# Altium project MiniRacer_V2.PrjPCB
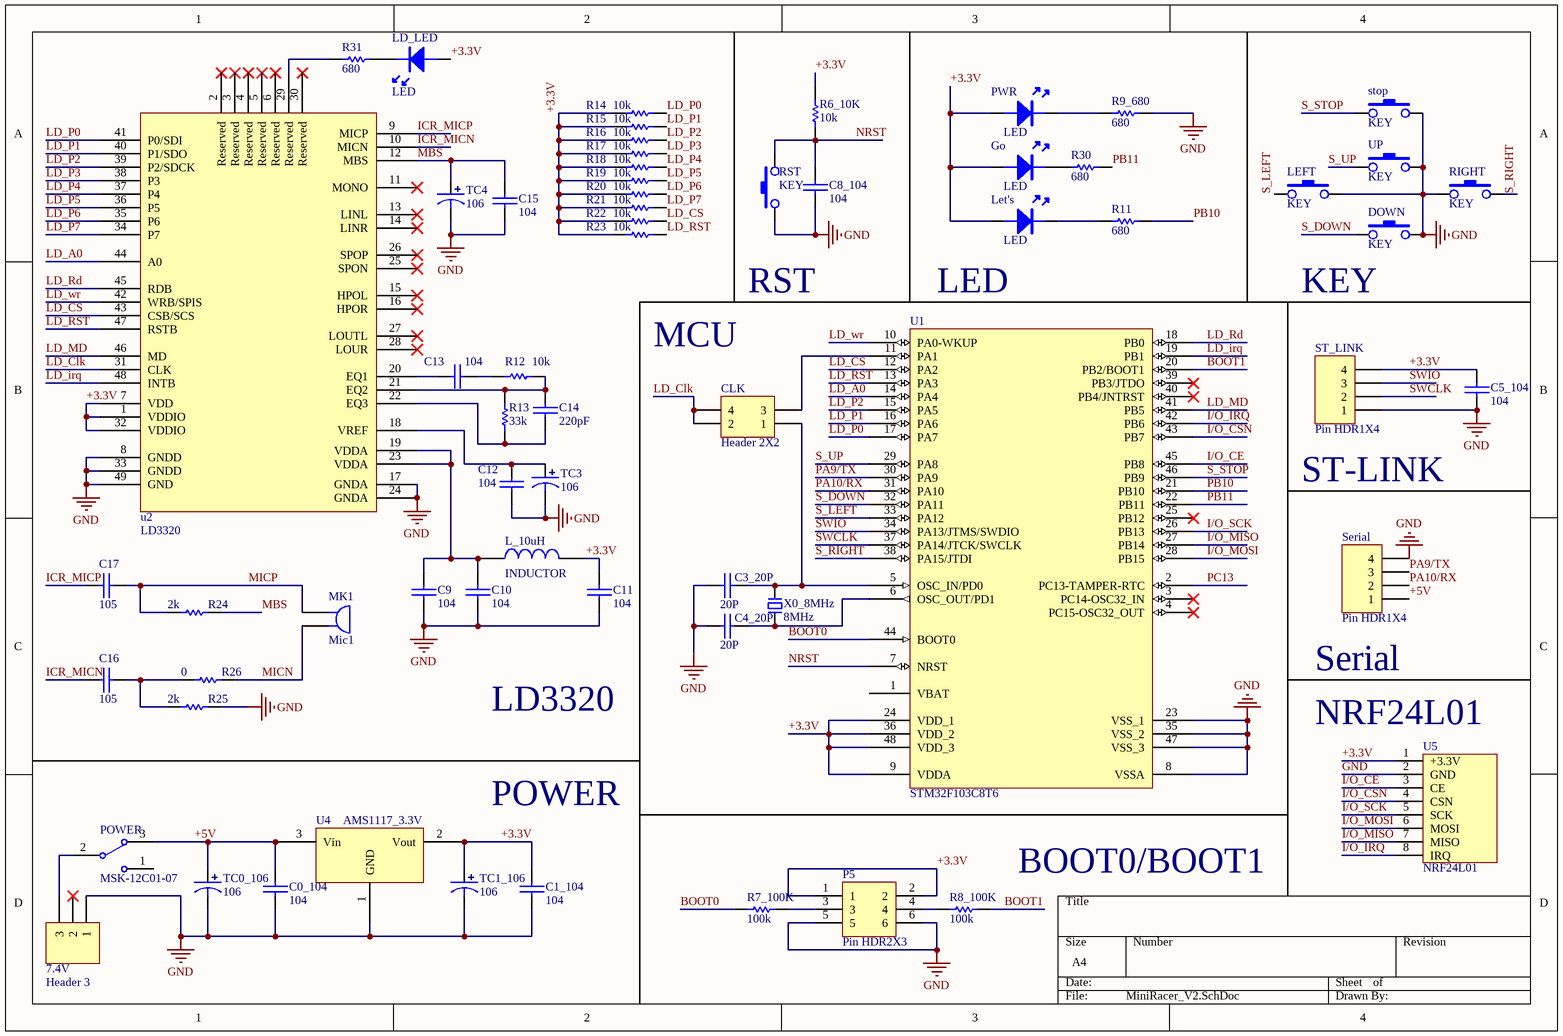
[diagram p0: MiniRacer_V2.SchDoc]
1 sheet, 64 parts. Net scope: global (net labels, ports and power ports of the same name join across sheets).
Board file: MiniRacer_V2.PcbDoc

## Sheet MiniRacer_V2.SchDoc
size A4

### Parts
7.4V  Header 3  [HDR1X3]
C0_104  104  [0603C]
C1_104  104  [0603C]
C3_20P  20P  [0603C]
C4_20P  20P  [0603C]
C5_104  104  [0603C]
C8_104  104  [0603C]
C9  104  [0603C]
C10  104  [0603C]
C11  104  [0603C]
C12  104  [0603C]
C13  104  [0603C]
C14  220pF  [0603C]
C15  104  [0603C]
C16  105  [0603C]
C17  105  [0603C]
CLK  Header 2X2  [HDR2X2]
DOWN  KEY  [DIP-3X6X4.3]
Go  LED  [LED-0603Y]
L_10uH  INDUCTOR  [0603L]
LD_LED  LED  [LED-0603Y]
LEFT  KEY  [DIP-3X6X4.3]
Let's  LED  [LED-0603Y]
MK1  Mic1  [PIN2]
P5  Pin HDR2X3  [Pin HDR2X3/2.54mm-S]
POWER  MSK-12C01-07  [MSK-12C01-07]
PWR  LED  [LED-0603Y]
R6_10K  10k  [0603R]
R7_100K  100k  [0603R]
R8_100K  100k  [0603R]
R9_680  680  [0603R]
R11  680  [0603R]
R12  10k  [0603R]
R13  33k  [0603R]
R14  10k  [0603R]
R15  10k  [0603R]
R16  10k  [0603R]
R17  10k  [0603R]
R18  10k  [0603R]
R19  10k  [0603R]
R20  10k  [0603R]
R21  10k  [0603R]
R22  10k  [0603R]
R23  10k  [0603R]
R24  2k  [0603R]
R25  2k  [0603R]
R26  0  [0603R]
R30  680  [0603R]
R31  680  [0603R]
RIGHT  KEY  [DIP-3X6X4.3]
RST  KEY  [SMD-3X6X2.5]
Serial  Pin HDR1X4  [HDR1X4]
ST_LINK  Pin HDR1X4  [HDR1X4]
stop  KEY  [DIP-3X6X4.3]
TC0_106  106  [TAJ-A/3216]
TC1_106  106  [TAJ-A/3216]
TC3  106  [TAJ-A/3216]
TC4  106  [TAJ-A/3216]
U1  STM32F103C8T6  [LQFP48 7X7]
u2  LD3320  [QFN50P700X700-48VAN]
U4  AMS1117_3.3V  [SOT223]
U5  NRF24L01  [NRF24L01]
UP  KEY  [DIP-3X6X4.3]
X0_8MHz  8MHz  [OSC 5032-2P]

### Nets
GND: 7.4V.1 C0_104.1 C1_104.1 C3_20P.2 C4_20P.2 C5_104.2 C8_104.2 C9.2 C10.2 C11.2 C12.2 C15.2 DOWN.3 LEFT.3 P5.5 P5.6 R9_680.1 R25.2 RIGHT.1 RST.1 Serial.4 ST_LINK.1 stop.3 TC0_106.2 TC1_106.2 TC3.2 TC4.2 U1.8(VSSA) U1.23(VSS_1) U1.35(VSS_2) U1.47(VSS_3) u2.8(GNDD) u2.17(GNDA) u2.24(GNDA) u2.33(GNDD) u2.49(GND) U4.1(GND) U5.2(GND) UP.3
+3.3V: C1_104.2 C5_104.1 C11.1 Go.A L_10uH.2 LD_LED.A Let's.A P5.1 P5.2 PWR.A R6_10K.2 R14.1 R15.1 R16.1 R17.1 R18.1 R19.1 R20.1 R21.1 R22.1 R23.1 ST_LINK.4 TC1_106.1 U1.9(VDDA) U1.24(VDD_1) U1.36(VDD_2) U1.48(VDD_3) u2.1(VDDIO) u2.7(VDD) u2.32(VDDIO) U4.2(Vout) U5.1(+3.3V)
+5V: C0_104.2 POWER.3 Serial.1 TC0_106.1 U4.3(Vin)
BOOT0: R7_100K.2 U1.44(BOOT0)
BOOT1: R8_100K.1 U1.20(PB2/BOOT1)
I/O_CE: U1.45(PB8) U5.3(CE)
I/O_CSN: U1.43(PB7) U5.4(CSN)
I/O_IRQ: U1.42(PB6) U5.8(IRQ)
I/O_MISO: U1.27(PB14) U5.7(MISO)
I/O_MOSI: U1.28(PB15) U5.6(MOSI)
I/O_SCK: U1.26(PB13) U5.5(SCK)
ICR_MICN: C16.1 u2.10(MICN)
ICR_MICP: C17.1 u2.9(MICP)
LD_A0: U1.14(PA4) u2.44(A0)
LD_Clk: CLK.2 CLK.4 u2.31(CLK)
LD_CS: R22.2 U1.12(PA2) u2.43(CSB/SCS)
LD_irq: U1.19(PB1) u2.48(INTB)
LD_MD: U1.41(PB5) u2.46(MD)
LD_P0: R14.2 U1.17(PA7) u2.41(P0/SDI)
LD_P1: R15.2 U1.16(PA6) u2.40(P1/SDO)
LD_P2: R16.2 U1.15(PA5) u2.39(P2/SDCK)
LD_P3: R17.2 u2.38(P3)
LD_P4: R18.2 u2.37(P4)
LD_P5: R19.2 u2.36(P5)
LD_P6: R20.2 u2.35(P6)
LD_P7: R21.2 u2.34(P7)
LD_Rd: U1.18(PB0) u2.45(RDB)
LD_RST: R23.2 U1.13(PA3) u2.47(RSTB)
LD_wr: U1.10(PA0-WKUP) u2.42(WRB/SPIS)
MBS: C15.1 R24.2 TC4.1 u2.12(MBS)
MICN: MK1.2 R26.2
MICP: C17.2 MK1.1 R24.1
NRST: C8_104.1 R6_10K.1 RST.3 U1.7(NRST)
PA9/TX: Serial.3 U1.30(PA9)
PA10/RX: Serial.2 U1.31(PA10)
PB10: R11.1 U1.21(PB10)
PB11: R30.1 U1.22(PB11)
PC13: U1.2(PC13-TAMPER-RTC)
S_DOWN: DOWN.1 U1.32(PA11)
S_LEFT: LEFT.1 U1.33(PA12)
S_RIGHT: RIGHT.3 U1.38(PA15/JTDI)
S_STOP: stop.1 U1.46(PB9)
S_UP: U1.29(PA8) UP.1
SWCLK: ST_LINK.2 U1.37(PA14/JTCK/SWCLK)
SWIO: ST_LINK.3 U1.34(PA13/JTMS/SWDIO)
Net7.4V_3: 7.4V.3 POWER.2
NetC3_20P_1: C3_20P.1 CLK.1 U1.5(OSC_IN/PD0) X0_8MHz.2
NetC4_20P_1: C4_20P.1 U1.6(OSC_OUT/PD1) X0_8MHz.1
NetC9_1: C9.1 C10.1 L_10uH.1 u2.19(VDDA) u2.23(VDDA)
NetC12_1: C12.1 TC3.1 u2.18(VREF)
NetC13_1: C13.1 u2.20(EQ1)
NetC13_2: C13.2 R12.2
NetC14_1: C14.1 R12.1 R13.1 u2.21(EQ2)
NetC14_2: C14.2 R13.2 u2.22(EQ3)
NetC16_2: C16.2 R25.1 R26.1
NetCLK_3: CLK.3 U1.11(PA1)
NetGo_K: Go.K R30.2
NetLD_LED_K: LD_LED.K R31.2
NetLet's_K: Let's.K R11.2
NetP5_3: P5.3 R7_100K.1
NetP5_4: P5.4 R8_100K.2
NetPWR_K: PWR.K R9_680.2
NetR31_1: R31.1 u2.29(Reserved)

Not connected (* = marked no-connect by the designer): 7.4V 2*; POWER 1; U1 1(VBAT) 3(PC14-OSC32_IN)* 4(PC15-OSC32_OUT)* 25(PB12)* 39(PB3/JTDO)* 40(PB4/JNTRST)*; u2 2(Reserved)* 3(Reserved)* 4(Reserved)* 5(Reserved)* 6(Reserved)* 11(MONO)* 13(LINL)* 14(LINR)* 15(HPOL)* 16(HPOR)* 25(SPON)* 26(SPOP)* 27(LOUTL)* 28(LOUR)* 30(Reserved)*

### Notes on the sheet
- RST
- LED
- (near DOWN) KEY
- MCU
- (near ST_LINK) ST-LINK
- LD3320
- (near Serial) Serial
- (near U5) NRF24L01
- POWER
- BOOT0/BOOT1

### Library data of the parts
7.4V = Header 3: Header, 3-Pin; LatestRevisionDate: 17-Jul-2002; LatestRevisionNote: Re-released for DXP Platform.; Publisher: Altium Limited
C0_104 C1_104 C3_20P C4_20P C5_104 C8_104 C9-C17 = CAP: 无极性电容
CLK = Header 2X2: Header, 2-Pin, Dual row; LatestRevisionDate: 17-Jul-2002; LatestRevisionNote: Re-released for DXP Platform.; Publisher: Altium Limited
MK1 = Mic1: Microphone; Published: 24-Mar-1999; LatestRevisionDate: 17-Jul-2002; LatestRevisionNote: Re-released for DXP Platform.; PackageReference: PIN2; Publisher: Altium Limited
R6_10K R7_100K R8_100K R9_680 R11-R26 R30 R31 = RES
Serial ST_LINK = Header 4: Header, 4-Pin; LatestRevisionDate: 17-Jul-2002; LatestRevisionNote: Re-released for DXP Platform.; Publisher: Altium Limited
TC0_106 TC1_106 TC3 TC4 = TCAP: 钽电容
U4 = AMS1117: 三端稳压芯片
X0_8MHz = XTAL-2P: 2脚无源脚晶振